# Altium schematic sheet FPGA_Banks_DDR3.SchDoc
size A4; SheetNumber: 3; SheetTotal: 8
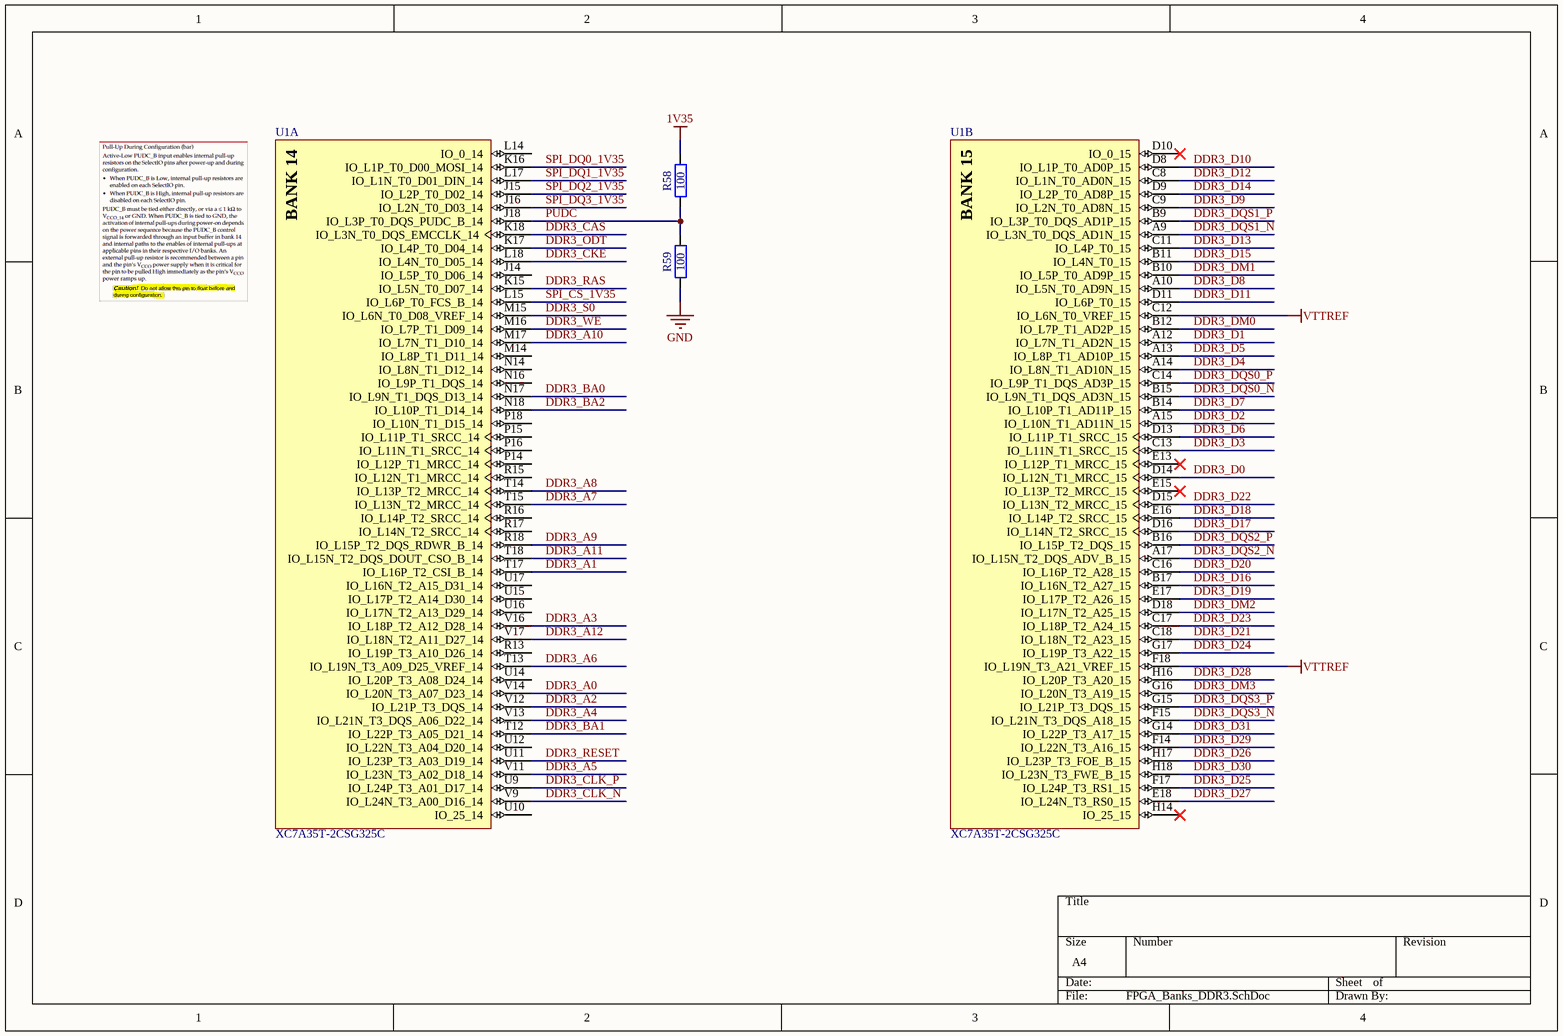
[diagram p0: FPGA_Banks_DDR3.SchDoc]

## Parts
R58  100  [GEN_R_0201]
R59  100  [GEN_R_0201]
U1  XC7A35T-2CSG325C  [CSG325]  (parts A,B of 9)

## Nets
1V35: R58.2
GND: R59.1
VTTREF: U1.C12(IO_L6N_T0_VREF_15) U1.F18(IO_L19N_T3_A21_VREF_15)
DDR3_A0: U1.V14(IO_L20N_T3_A07_D23_14)
DDR3_A1: U1.T17(IO_L16P_T2_CSI_B_14)
DDR3_A2: U1.V12(IO_L21P_T3_DQS_14)
DDR3_A3: U1.V16(IO_L18P_T2_A12_D28_14)
DDR3_A4: U1.V13(IO_L21N_T3_DQS_A06_D22_14)
DDR3_A5: U1.V11(IO_L23N_T3_A02_D18_14)
DDR3_A6: U1.T13(IO_L19N_T3_A09_D25_VREF_14)
DDR3_A7: U1.T15(IO_L13N_T2_MRCC_14)
DDR3_A8: U1.T14(IO_L13P_T2_MRCC_14)
DDR3_A9: U1.R18(IO_L15P_T2_DQS_RDWR_B_14)
DDR3_A10: U1.M17(IO_L7N_T1_D10_14)
DDR3_A11: U1.T18(IO_L15N_T2_DQS_DOUT_CSO_B_14)
DDR3_A12: U1.V17(IO_L18N_T2_A11_D27_14)
DDR3_BA0: U1.N17(IO_L9N_T1_DQS_D13_14)
DDR3_BA1: U1.T12(IO_L22P_T3_A05_D21_14)
DDR3_BA2: U1.N18(IO_L10P_T1_D14_14)
DDR3_CAS: U1.K18(IO_L3N_T0_DQS_EMCCLK_14)
DDR3_CKE: U1.L18(IO_L4N_T0_D05_14)
DDR3_CLK_N: U1.V9(IO_L24N_T3_A00_D16_14)
DDR3_CLK_P: U1.U9(IO_L24P_T3_A01_D17_14)
DDR3_D0: U1.D14(IO_L12N_T1_MRCC_15)
DDR3_D1: U1.A12(IO_L7N_T1_AD2N_15)
DDR3_D2: U1.A15(IO_L10N_T1_AD11N_15)
DDR3_D3: U1.C13(IO_L11N_T1_SRCC_15)
DDR3_D4: U1.A14(IO_L8N_T1_AD10N_15)
DDR3_D5: U1.A13(IO_L8P_T1_AD10P_15)
DDR3_D6: U1.D13(IO_L11P_T1_SRCC_15)
DDR3_D7: U1.B14(IO_L10P_T1_AD11P_15)
DDR3_D8: U1.A10(IO_L5N_T0_AD9N_15)
DDR3_D9: U1.C9(IO_L2N_T0_AD8N_15)
DDR3_D10: U1.D8(IO_L1P_T0_AD0P_15)
DDR3_D11: U1.D11(IO_L6P_T0_15)
DDR3_D12: U1.C8(IO_L1N_T0_AD0N_15)
DDR3_D13: U1.C11(IO_L4P_T0_15)
DDR3_D14: U1.D9(IO_L2P_T0_AD8P_15)
DDR3_D15: U1.B11(IO_L4N_T0_15)
DDR3_D16: U1.B17(IO_L16N_T2_A27_15)
DDR3_D17: U1.D16(IO_L14N_T2_SRCC_15)
DDR3_D18: U1.E16(IO_L14P_T2_SRCC_15)
DDR3_D19: U1.E17(IO_L17P_T2_A26_15)
DDR3_D20: U1.C16(IO_L16P_T2_A28_15)
DDR3_D21: U1.C18(IO_L18N_T2_A23_15)
DDR3_D22: U1.D15(IO_L13N_T2_MRCC_15)
DDR3_D23: U1.C17(IO_L18P_T2_A24_15)
DDR3_D24: U1.G17(IO_L19P_T3_A22_15)
DDR3_D25: U1.F17(IO_L24P_T3_RS1_15)
DDR3_D26: U1.H17(IO_L23P_T3_FOE_B_15)
DDR3_D27: U1.E18(IO_L24N_T3_RS0_15)
DDR3_D28: U1.H16(IO_L20P_T3_A20_15)
DDR3_D29: U1.F14(IO_L22N_T3_A16_15)
DDR3_D30: U1.H18(IO_L23N_T3_FWE_B_15)
DDR3_D31: U1.G14(IO_L22P_T3_A17_15)
DDR3_DM0: U1.B12(IO_L7P_T1_AD2P_15)
DDR3_DM1: U1.B10(IO_L5P_T0_AD9P_15)
DDR3_DM2: U1.D18(IO_L17N_T2_A25_15)
DDR3_DM3: U1.G16(IO_L20N_T3_A19_15)
DDR3_DQS0_N: U1.B15(IO_L9N_T1_DQS_AD3N_15)
DDR3_DQS0_P: U1.C14(IO_L9P_T1_DQS_AD3P_15)
DDR3_DQS1_N: U1.A9(IO_L3N_T0_DQS_AD1N_15)
DDR3_DQS1_P: U1.B9(IO_L3P_T0_DQS_AD1P_15)
DDR3_DQS2_N: U1.A17(IO_L15N_T2_DQS_ADV_B_15)
DDR3_DQS2_P: U1.B16(IO_L15P_T2_DQS_15)
DDR3_DQS3_N: U1.F15(IO_L21N_T3_DQS_A18_15)
DDR3_DQS3_P: U1.G15(IO_L21P_T3_DQS_15)
DDR3_ODT: U1.K17(IO_L4P_T0_D04_14)
DDR3_RAS: U1.K15(IO_L5N_T0_D07_14)
DDR3_RESET: U1.U11(IO_L23P_T3_A03_D19_14)
DDR3_S0: U1.M15(IO_L6N_T0_D08_VREF_14)
DDR3_WE: U1.M16(IO_L7P_T1_D09_14)
PUDC: R58.1 R59.2 U1.J18(IO_L3P_T0_DQS_PUDC_B_14)
SPI_CS_1V35: U1.L15(IO_L6P_T0_FCS_B_14)
SPI_DQ0_1V35: U1.K16(IO_L1P_T0_D00_MOSI_14)
SPI_DQ1_1V35: U1.L17(IO_L1N_T0_D01_DIN_14)
SPI_DQ2_1V35: U1.J15(IO_L2P_T0_D02_14)
SPI_DQ3_1V35: U1.J16(IO_L2N_T0_D03_14)

Not connected (* = marked no-connect by the designer): U1 D10(IO_0_15)* E13(IO_L12P_T1_MRCC_15)* E15(IO_L13P_T2_MRCC_15)* H14(IO_25_15)* J14(IO_L5P_T0_D06_14) L14(IO_0_14) M14(IO_L8P_T1_D11_14) N14(IO_L8N_T1_D12_14) N16(IO_L9P_T1_DQS_14) P14(IO_L12P_T1_MRCC_14) P15(IO_L11P_T1_SRCC_14) P16(IO_L11N_T1_SRCC_14) P18(IO_L10N_T1_D15_14) R13(IO_L19P_T3_A10_D26_14) R15(IO_L12N_T1_MRCC_14) R16(IO_L14P_T2_SRCC_14) R17(IO_L14N_T2_SRCC_14) U10(IO_25_14) U12(IO_L22N_T3_A04_D20_14) U14(IO_L20P_T3_A08_D24_14) U15(IO_L17P_T2_A14_D30_14) U16(IO_L17N_T2_A13_D29_14) U17(IO_L16N_T2_A15_D31_14)

## Notes on the sheet
- (in symbol XC7A35T-2CSG325C, part A) BANK 14
- (in symbol XC7A35T-2CSG325C, part B) BANK 15

## Library data of the parts
R58 R59 = RES 100 OHM 1% 1/20W 0201: Tolerance: 1%; Power Rating: 0.05W; Package: 0201; Value: 100; Supplier 1: Digi-Key; Supplier Part Number 1: 311-100MCT-ND
U1 = XC7A35T-2CSG325C: Artix-7 FPGA, 150 User I/Os, 4 GTP, 324-Ball BGA, Speed Grade 2, Commercial Grade, Pb-Free; Manufacturer: Xilinx; Total Block RAM: 1800 Kb; GTP: 4; Clock Mgmt Tiles (CMTs): 5; Logic Cells: 33280; Available User I/O: 150; Speed Grades: 2; DatasheetVersion: v1.15; PackageVersion: Rev. 1.11; PackageReference: CSG-325; PackageDescription: 324-Ball Wire-Bond Chip-Scale BGA, Body 15 x 15 mm, Pitch 0.8 mm; Maximum Distributed RAM: 400 Kb; Operating Temperature Range: Commercial; NexusDeviceID: XC7A35T-2CSG325C; Mounting Technology: Surface Mount; PartNumber: XC7A35T-2CSG325C; ComponentLink1Description: Manufacturer URL; ComponentLink1URL: http://www.xilinx.com/; ComponentLink2Description: Datasheet; ComponentLink2URL: http://www.xilinx.com/support/documentation/data_sheets/ds180_7Series_Overview.pdf; ComponentLink3Description: Package Specification; ComponentLink3URL: http://www.xilinx.com/support/documentation/user_guides/ug475_7Series_Pkg_Pinout.pdf; ComponentLink4Description: DC and Switching Characteristics; ComponentLink4URL: http://www.xilinx.com/support/documentation/data_sheets/ds181_Artix_7_Data_Sheet.pdf; ComponentLink5Description: Package File; ComponentLink5URL: http://www.xilinx.com/support/packagefiles/a7packages/xc7a200tsbg484pkg.txt; ComponentLink6Description: Packaging and Pinout; ComponentLink6URL: http://www.xilinx.com/support/documentation/user_guides/ug475_7Series_Pkg_Pinout.pdf